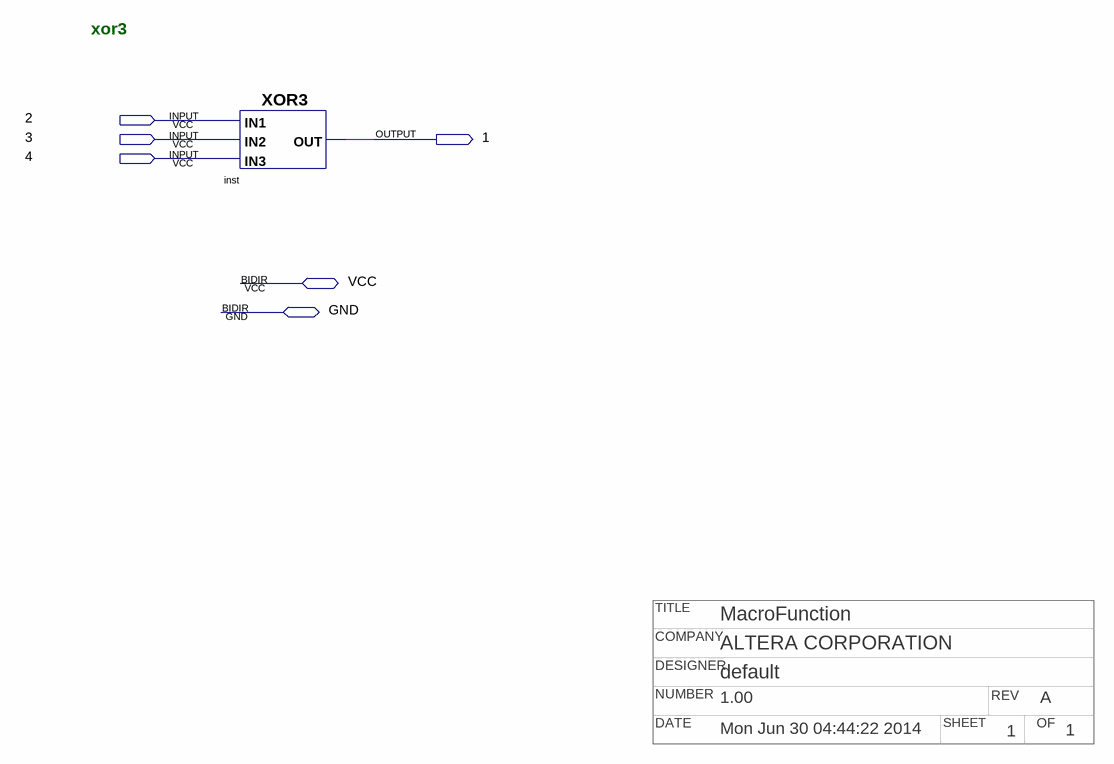
[diagram p0: schematic sheet]
// Quartus schematic npxor3.bdf as structural Verilog: 1 symbols, 6 pins
// Title block: TITLE: MacroFunction; COMPANY: ALTERA CORPORATION; DESIGNER: default; NUMBER: 1.00; REV: A; DATE: Mon Jun 30 04:44:22 2014; SHEET: 1; OF: 1
module npxor3 (
  input  \2 ,
  input  \3 ,
  input  \4 ,
  inout  VCC,
  inout  GND,
  output \1 
);

  XOR3 inst (.IN3(\4 ), .IN1(\2 ), .IN2(\3 ), .OUT(\1 ));

  // Notes on the sheet:
  //   xor3
endmodule
